# Altium schematic sheet stepper-encoder-lcd.SchDoc
size A
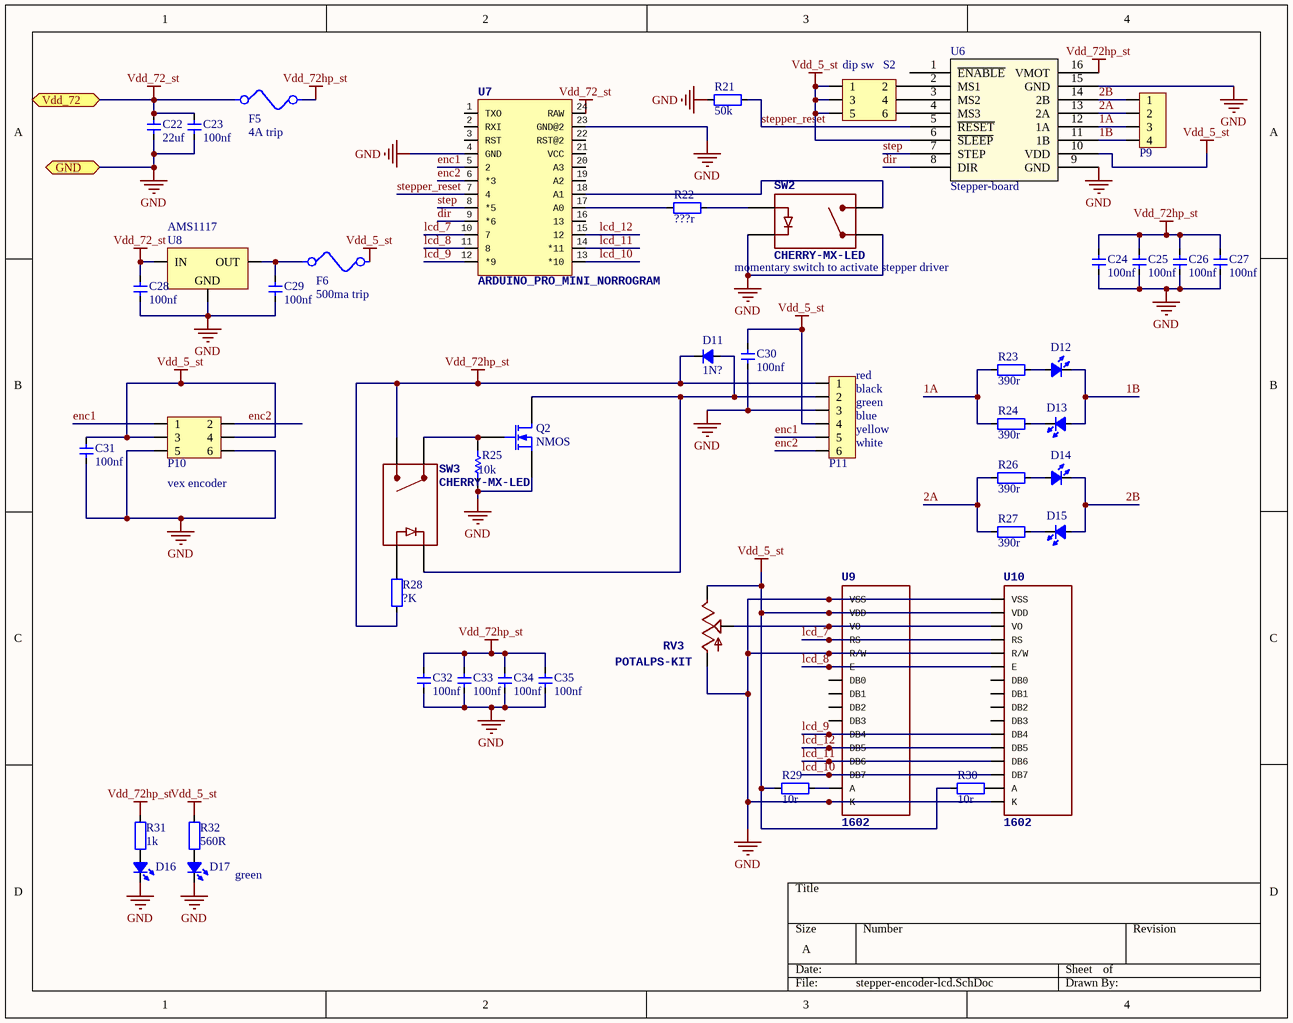
[diagram p0: stepper-encoder-lcd.SchDoc]

## Parts
C22  value 22uf  [CAP_0805]  (hidden comment: Cap_0805)
C23  value 100nf  [CAP_0805]  (hidden comment: Cap_0805)
C24  value 100nf  [CAP_0805]  (hidden comment: Cap_0805)
C25  value 100nf  [CAP_0805]  (hidden comment: Cap_0805)
C26  value 100nf  [CAP_0805]  (hidden comment: Cap_0805)
C27  value 100nf  [CAP_0805]  (hidden comment: Cap_0805)
C28  value 100nf  [CAP_0805]  (hidden comment: Cap_0805)
C29  value 100nf  [CAP_0805]  (hidden comment: Cap_0805)
C30  value 100nf  [CAP_0805]  (hidden comment: Cap_0805)
C31  value 100nf  [CAP_0805]  (hidden comment: Cap_0805)
C32  value 100nf  [CAP_0805]  (hidden comment: Cap_0805)
C33  value 100nf  [CAP_0805]  (hidden comment: Cap_0805)
C34  value 100nf  [CAP_0805]  (hidden comment: Cap_0805)
C35  value 100nf  [CAP_0805]  (hidden comment: Cap_0805)
D11  value 1N?  [SOD-323]  (hidden comment: Diode_SOD323)
D12  LED_0805  [LED_0805_YELLOW]  (value not drawn)
D13  LED_0805  [LED_0805_YELLOW]  (value not drawn)
D14  LED_0805  [LED_0805_YELLOW]  (value not drawn)
D15  LED_0805  [LED_0805_YELLOW]  (value not drawn)
D16  LED_0805  [LED_0805_RED]  (value not drawn)
D17  LED_0805  [LED_0805_RED]  (value not drawn)
F5  4A trip  [Multifuse1812]
F6  500ma trip  [Multifuse1812]
P9  HDR1x4_2.54  [HDR1x4_2.54_180]  (value not drawn)
P10  HDR2x3_2.54  [HDR2X3_2.54_180]  (value not drawn)
P11  HDR1x6_2.54  [HDR1X6_2.54_180]  (value not drawn)
Q2  NMOS  [SOT23-3]
R21  value 50k  [RES_0805]  (hidden comment: Res_0805)
R22  value ???r  [RES_0805]  (hidden comment: Res_0805)
R23  value 390r  [RES_0805]  (hidden comment: Res_0805)
R24  value 390r  [RES_0805]  (hidden comment: Res_0805)
R25  value 10k  [RES_0805]  (hidden comment: R2)
R26  value 390r  [RES_0805]  (hidden comment: Res_0805)
R27  value 390r  [RES_0805]  (hidden comment: Res_0805)
R28  value ?K  [RES_0805]  (hidden comment: Res_0805)
R29  value 10r  [RES_0805]  (hidden comment: Res_0805)
R30  value 10r  [RES_0805]  (hidden comment: Res_0805)
R31  value 1k  [RES_0805]  (hidden comment: Res_0805)
R32  value 560R  [RES_0805]  (hidden comment: Res_0805)
RV3  POTALPS-KIT  [Bourns-slimline-axialbracket]
S2  HDR2x3_2.54  [DIP6]  (value not drawn)
SW2  CHERRY-MX-LED  [MX-LED]
SW3  CHERRY-MX-LED  [MX-LED]
U6  Stepper-board  [stepper-board]
U7  ARDUINO_PRO_MINI_NORROGRAM  [ARDUINO_PRO_MINI_NOPROGRAM]
U8  AMS1117  [SOT223-3-CONNECTEDTAB]
U9  1602  [LCD-16X2_NOSILK]
U10  1602  [LCD-16X2_NOSILK]

## Ports
GND, Vdd_72

## Nets
GND: C22.1 C23.1 C24.2 C25.2 C26.2 C27.2 C28.1 C29.1 C30.2 C31.2 C32.2 C33.2 C34.2 C35.2 D16.2(K) D17.2(K) P10.5 P10.6 P11.3 Q2.3(S) R21.1 R25.1 RV3.P$3(A) SW2.P$1 SW2.P$3 U6.9(GND) U6.15(GND) U7.4(GND) U7.23(GND@2) U8.1(GND) U9.1(VSS) U9.5(R/W) U9.16(K) U10.1(VSS) U10.5(R/W) U10.16(K) ; port GND
Vdd_5_st: C30.1 C31.1 F6.2 P10.3 P10.4 P11.4 R29.1 R30.1 R32.2 RV3.P$1(E) S2.1 S2.3 S2.5 U6.6(~{SLEEP}) U6.10(VDD) U9.2(VDD) U10.2(VDD)
Vdd_72_st: C22.2 C23.2 C28.2 F5.1 U7.24(RAW) U8.3(IN) ; port Vdd_72
Vdd_72hp_st: C24.1 C25.1 C26.1 C27.1 C32.1 C33.1 C34.1 C35.1 D11.2(K) F5.2 P11.1 R28.1 R31.2 SW3.P$2 U6.16(VMOT)
1A: P9.3 R23.1 R24.1 U6.12(1A)
1B: D12.2(K) D13.1(A) P9.4 U6.11(1B)
2A: P9.2 R26.1 R27.1 U6.13(2A)
2B: D14.2(K) D15.1(A) P9.1 U6.14(2B)
dir: U6.8(DIR) U7.9(*6)
enc1: P10.1 P11.5 U7.5(2)
enc2: P10.2 P11.6 U7.6(*3)
lcd_7: U7.10(7) U9.4(RS) U10.4(RS)
lcd_8: U7.11(8) U9.6(E) U10.6(E)
lcd_9: U7.12(*9) U9.11(DB4) U10.11(DB4)
lcd_10: U7.13(*10) U9.14(DB7) U10.14(DB7)
lcd_11: U7.14(*11) U9.13(DB6) U10.13(DB6)
lcd_12: U7.15(12) U9.12(DB5) U10.12(DB5)
step: U6.7(STEP) U7.8(*5)
stepper_reset: R21.2 U6.5(~{RESET}) U7.7(4)
NetC29_2: C29.2 F6.1 U8.2(OUT)
NetD11_1: D11.1(A) P11.2 Q2.1(D) SW3.P$3
NetD12_1: D12.1(A) R23.2
NetD13_2: D13.2(K) R24.2
NetD14_1: D14.1(A) R26.2
NetD15_2: D15.2(K) R27.2
NetD16_1: D16.1(A) R31.1
NetD17_1: D17.1(A) R32.1
NetQ2_2: Q2.2(G) R25.2 SW3.P$1
NetR22_1: R22.1 U7.17(A0)
NetR22_2: R22.2 SW2.P$4
NetR28_2: R28.2 SW3.P$4
NetR29_2: R29.2 U9.15(A)
NetR30_2: R30.2 U10.15(A)
NetRV3_P$2: RV3.P$2(S) U9.3(VO) U10.3(VO)
NetS2_2: S2.2 U6.2(MS1)
NetS2_4: S2.4 U6.3(MS2)
NetS2_6: S2.6 U6.4(MS3)
NetSW2_P$2: SW2.P$2 U7.18(A1)

Not connected (* = marked no-connect by the designer): U6 1(~{ENABLE}); U7 1(TXO) 2(RXI) 3(RST) 16(13) 19(A2) 20(A3) 21(VCC) 22(RST@2); U9 7(DB0) 8(DB1) 9(DB2) 10(DB3); U10 7(DB0) 8(DB1) 9(DB2) 10(DB3)

## Notes on the sheet
- (near S2) dip sw
- (near SW2) momentary switch to activate stepper driver
- (near P11) red
- (near P11) black
- (near P11) green
- (near P11) blue
- (near P11) yellow
- (near P10) vex encoder
- (near P11) white
- green

## Library data of the parts
C22-C35 = Cap_0805: Capacitor
D11 = Diode_SOD323: Diode
D12-D17 = LED_0805: LED
F5 F6 = Multifuse: RO ZEK MULTI 500MA SMD 1812 MF-MSMF050-2 BOURNS; ID: Library_FUSE-0001; Faber ItemCode: 35502800; Info: MULTIFUSE, SMD, 0.5A; Value: 0.5A; Mfg: BOURNS; Mfg code: MF-MSMF050-2
P9 = HDR1x4_2.54: Header
P10 = HDR2x3_2.54: Header
P11 = HDR1x6_2.54: Header
Q2 = MOSFET-N: N-Channel MOSFET; pin to pad: 1>3 2>1 3>2; Published: 8-Jun-2000; LatestRevisionDate: 17-Jul-2002; LatestRevisionNote: Re-released for DXP Platform.; PackageVersion: 1995/1996; PackageReference: E3; Publisher: Altium Limited; PackageDescription: TO, Flat Index; 3 In-Line, Axial Leads; Body Dia. 4.6mm; Lead Dia. 0.5 mm (max)
R21-R24 R26-R32 = Res_0805: Resistor
R25 = Res1: Resistor; Published: 8-Jun-2000; LatestRevisionDate: 17-Jul-2002; LatestRevisionNote: Re-released for DXP Platform.; PackageReference: AXIAL-0.3; Publisher: Altium Limited; PackageDescription: Axial Device, Thru-Hole; 2 Leads; 0.3 in Pin Spacing
RV3 = POTALPS-KIT: pin to pad: P$1>1 P$2>2 P$3>3; PROD_ID: RES-09177
S2 = HDR2x3_2.54: Header; pin to pad: 2>6 3>2 4>5 5>3 6>4
U8 = AMS1117: Power
U9 U10 = LCD-16X2NOSILK